# EAGLE design MJ828 - prod (EAGLE 9.4.0)
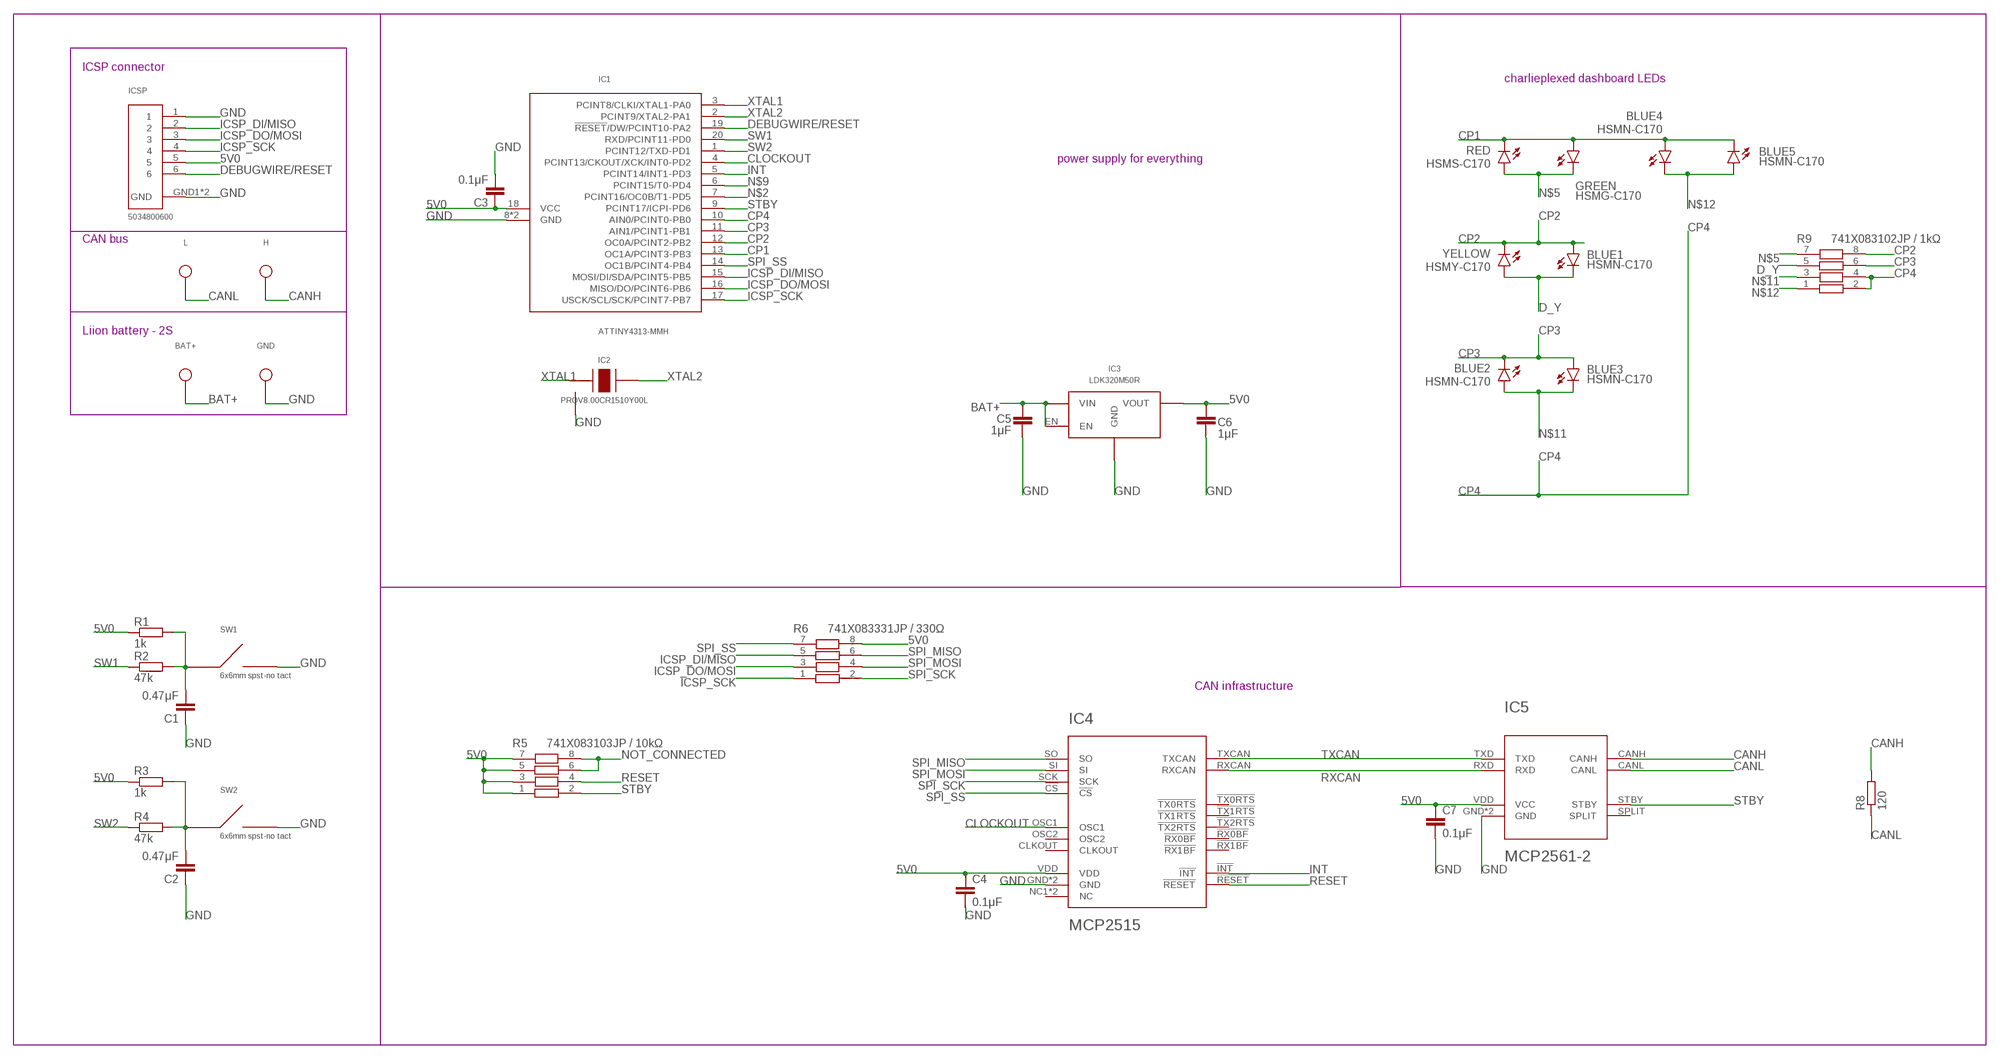
[diagram p0: schematic, sheet 1]

## Parts
BAT+  8V4 Battery +  TPTH-0.9MM  [TH-0.9MM]
BLUE1  HSMN-C170  LEDSML0805  [SML0805]
BLUE2  HSMN-C170  LEDSML0805  [SML0805]
BLUE3  HSMN-C170  LEDSML0805  [SML0805]
BLUE4  HSMN-C170  LEDSML0805  [SML0805]
BLUE5  HSMN-C170  LEDSML0805  [SML0805]
C1  0.47μF  C-EUC0402  [C0402]
C2  0.47μF  C-EUC0402  [C0402]
C3  0.1μF  C-EUC0402  [C0402]
C4  0.1μF  C-EUC0402  [C0402]
C5  1μF  C-EUC0402  [C0402]
C6  1μF  C-EUC0402  [C0402]
C7  0.1μF  C-EUC0402  [C0402]
GND  Ground  TPTH-0.9MM  [TH-0.9MM]
GREEN  HSMG-C170  LEDSML0805  [SML0805]
H  CAN High  TPTH-0.9MM  [TH-0.9MM]
IC1  ATTINY4313-MMH  ATTINY4313VQFN-20  [VQFN-20]
IC2  PRQV8.00CR1510Y00L  PRQV  [SMT]
IC3  LDK320M50R  LDK320SOT-23-5L  [SOT-23-5L]
IC4  MCP2515  MCP2515-I-ML  [QFN20]
IC5  MCP2561-2  [DFN10]
ICSP  5034800600  [SMT]
L  CAN Low  TPTH-0.9MM  [TH-0.9MM]
R1  1k  R-EU_R0402  [R0402]
R2  47k  R-EU_R0402  [R0402]
R3  1k  R-EU_R0402  [R0402]
R4  47k  R-EU_R0402  [R0402]
R5  741X083103JP / 10kΩ  741X083331JP  [0402]
R6  741X083331JP / 330Ω  741X083331JP  [0402]
R8  120  R-EU_R0402  [R0402]
R9  741X083102JP / 1kΩ  741X083331JP  [0402]
RED  HSMS-C170  LEDSML0805  [SML0805]
SW1  6x6mm spst-no tact  TL3305-844809  [SMD]
SW2  6x6mm spst-no tact  TL3305-844809  [SMD]
YELLOW  HSMY-C170  LEDSML0805  [SML0805]

## Nets
5V0 [5v0]: C3.1 C4.1 C6.2 C7.1 IC1.18(VCC) IC3.OUT(VOUT) IC4.VDD IC5.VDD(VCC) ICSP.5 R1.1 R3.1 R5.1 R5.3 R5.5 R5.7 R6.8
BAT+ [Bat+]: BAT+.TP$1 C5.1 IC3.EN IC3.IN(VIN)
CANH [5v0]: H.TP$1 IC5.CANH R8.2
CANL [5v0]: IC5.CANL L.TP$1 R8.1
CLOCKOUT [signal]: IC1.4(PCINT13/CKOUT/XCK/INT0-PD2) IC4.OSC1
CP1 [signal]: BLUE4.A BLUE5.C GREEN.A IC1.13(OC1A/PCINT3-PB3) RED.C
CP2 [signal]: BLUE1.A IC1.12(OC0A/PCINT2-PB2) R9.8 YELLOW.C
CP3 [signal]: BLUE2.C BLUE3.A IC1.11(AIN1/PCINT1-PB1) R9.6
CP4 [signal]: IC1.10(AIN0/PCINT0-PB0) R9.2 R9.4
D_Y [signal]: BLUE1.C R9.5 YELLOW.A
DEBUGWIRE/RESET [signal]: IC1.19(!RESET!/DW/PCINT10-PA2) ICSP.6
GND: C1.1 C2.1 C3.2 C4.2 C5.2 C6.1 C7.2 GND.TP$1 IC1.8(GND) IC1.GND IC2.GND IC3.GND IC4.GND IC4.GND6(GND) IC5.GND IC5.VSS(GND) ICSP.1 ICSP.GND1(GND) ICSP.GND2(GND) SW1.3 SW1.4 SW2.3 SW2.4
ICSP_DI/MISO [signal]: IC1.15(MOSI/DI/SDA/PCINT5-PB5) ICSP.2 R6.5
ICSP_DO/MOSI [signal]: IC1.16(MISO/DO/PCINT6-PB6) ICSP.3 R6.3
ICSP_SCK [signal]: IC1.17(USCK/SCL/SCK/PCINT7-PB7) ICSP.4 R6.1
INT [signal]: IC1.5(PCINT14/INT1-PD3) IC4.!INT!
N$1: C1.2 R1.2 R2.2 SW1.1 SW1.2
N$2: IC1.7(PCINT16/OC0B/T1-PD5)
N$5 [signal]: GREEN.C R9.7 RED.A
N$7: C2.2 R3.2 R4.2 SW2.1 SW2.2
N$9: IC1.6(PCINT15/T0-PD4)
N$11 [signal]: BLUE2.A BLUE3.C R9.3
N$12 [signal]: BLUE4.C BLUE5.A R9.1
NOT_CONNECTED: R5.6 R5.8
RESET [signal]: IC4.!RESET! R5.4
RXCAN [signal]: IC4.RXCAN IC5.RXD
SPI_MISO [signal]: IC4.SO R6.6
SPI_MOSI [signal]: IC4.SI R6.4
SPI_SCK: IC4.SCK R6.2
SPI_SS [signal]: IC1.14(OC1B/PCINT4-PB4) IC4.!CS! R6.7
STBY [signal]: IC1.9(PCINT17/ICPI-PD6) IC5.STBY R5.2
SW1 [signal]: IC1.20(RXD/PCINT11-PD0) R2.1
SW2 [signal]: IC1.1(PCINT12/TXD-PD1) R4.1
TXCAN [signal]: IC4.TXCAN IC5.TXD
XTAL1 [signal]: IC1.3(PCINT8/CLKI/XTAL1-PA0) IC2.XTAL1
XTAL2 [signal]: IC1.2(PCINT9/XTAL2-PA1) IC2.XTAL2
Unconnected: IC4.!RX0BF! IC4.!RX1BF! IC4.!TX0RTS! IC4.!TX1RTS! IC4.!TX2RTS! IC4.CLKOUT IC4.NC1(NC) IC4.NC2(NC) IC4.OSC2 IC5.SPLIT

## Notes on the sheet
- ICSP connector
- charlieplexed dashboard LEDs
- power supply for everything
- CAN bus
- Liion battery - 2S
- CAN infrastructure

## Library data of the parts
BAT+ GND H L = signal testpoint:TP
BLUE1-BLUE5 GREEN RED YELLOW = led:LED: LED OSRAM: - CHIPLED LG R971, LG N971, LY N971, LG Q971, LY Q971, LO R971, LY R971 LH N974, LH R974 LS Q976, LO Q976, LY Q976 LO Q996 - Hyper CHIPLED LW Q18S LB Q993, LB Q99A, LB R99A - SideLED LS A670, LO A670, LY A670, LG A670, LP A670 LB A673, LV A673, LT A673, LW A673 LH A674 LY A675 LS A676, LA A676, LO A676, LY A676, LW A676 LS A679, LY A679, LG A679 - Hyper Micro SIDELED® LS Y876, LA Y876, LO Y876, LY Y876 LT Y87S - SmartLED LW L88C, LW L88S LB L89C, LB L89S, LG L890 LS L89K, LO L89K, LY L89K LS L896, LA L896, LO L896, LY L896 - TOPLED LS T670, LO T670, LY T670, LG T670, LP T670 LSG T670, LSP T670, LSY T670, LOP T670, LYG T670 LG T671, LOG T671, LSG T671 LB T673, LV T673, LT T673, LW T673 LH T674 LS T676, LA T676, LO T676, LY T676, LB T676, LH T676, LSB T676, LW T676 LB T67C, LV T67C, LT T67C, LS T67K, LO T67K, LY T67K, LW E67C LS E67B, LA E67B, LO E67B, LY E67B, LB E67C, LV E67C, LT E67C LW T67C LS T679, LY T679, LG T679 LS T770, LO T770, LY T770, LG T770, LP T770 LB T773, LV T773, LT T773, LW T773 LH T774 LS E675, LA E675, LY E675, LS T675 LS T776, LA T776, LO T776, LY T776, LB T776 LHGB T686 LT T68C, LB T68C - Hyper Mini TOPLED® LB M676 - Mini TOPLED Santana® LG M470 LS M47K, LO M47K, LY M47K Source: http://www.osram.convergy.de LUXEON: - LUMILED® LXK2-PW12-R00, LXK2-PW12-S00, LXK2-PW14-U00, LXK2-PW14-V00 LXK2-PM12-R00, LXK2-PM12-S00, LXK2-PM14-U00 LXK2-PE12-Q00, LXK2-PE12-R00, LXK2-PE12-S00, LXK2-PE14-T00, LXK2-PE14-U00 LXK2-PB12-K00, LXK2-PB12-L00, LXK2-PB12-M00, LXK2-PB14-N00, LXK2-PB14-P00, LXK2-PB14-Q00 LXK2-PR12-L00, LXK2-PR12-M00, LXK2-PR14-Q00, LXK2-PR14-R00 LXK2-PD12-Q00, LXK2-PD12-R00, LXK2-PD12-S00 LXK2-PH12-R00, LXK2-PH12-S00 LXK2-PL12-P00, LXK2-PL12-Q00, LXK2-PL12-R00 Source: www.luxeon.com KINGBRIGHT: KA-3528ASYC Source: www.kingbright.com
C1-C7 = rcl:C-EU: CAPACITOR, European symbol; SPICEPREFIX: C
IC1 = ATtiny4313 microcontroller:ATTINY4313; SPICEPREFIX: X
IC2 = PRQV8.00CR1510Y00L - 8MHz resonator:PRQV
IC3 = LDK320 5V LDO:LDK320
IC4 = MCP2515-I-ML - Standalonce CAN Controller with SPI Interface:MCP2515-I-ML
IC5 = MCP2561-2 - High-Speed CAN Transceiver:MCP2561-2
ICSP = 5034800600 FPC Connector:5034800600
R1-R4 R8 = rcl:R-EU_: RESISTOR, European symbol; SPICEPREFIX: R
R5 R6 R9 = 741X083331JP Resistor Array:741X083331JP
SW1 SW2 = TL3305-844809 SPST-NO Tact Switch:TL3305-844809

## Net classes
0 GND: width 0.254 mm, drill 0.254 mm, clearance 0.127 mm
1 Bat+: width 0.5 mm, drill 0.35 mm, clearance 0.2 mm
2 5v0: width 0.3 mm, drill 0.35 mm, clearance 0.2 mm
3 signal: width 0.25 mm, drill 0.35 mm, clearance 0.2 mm

## Board
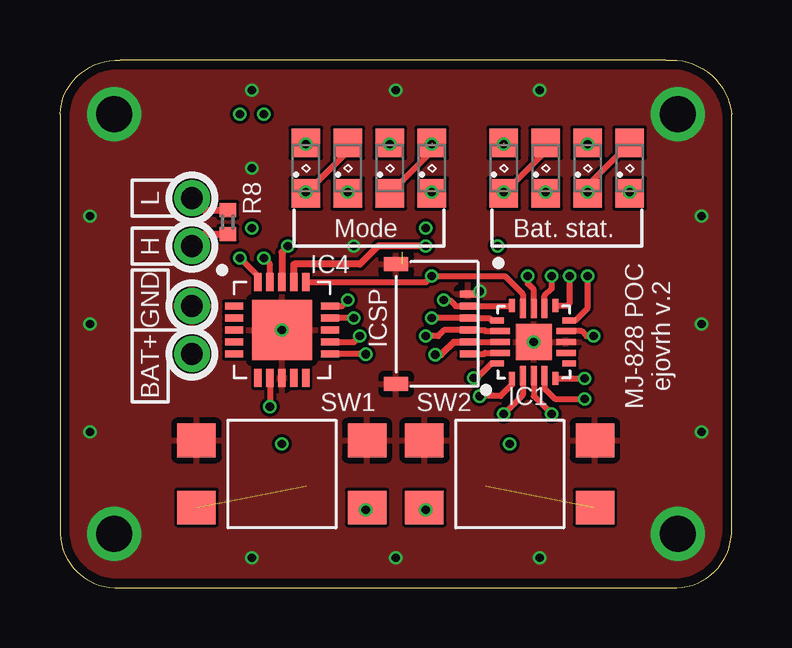
[diagram p1: board, top side]
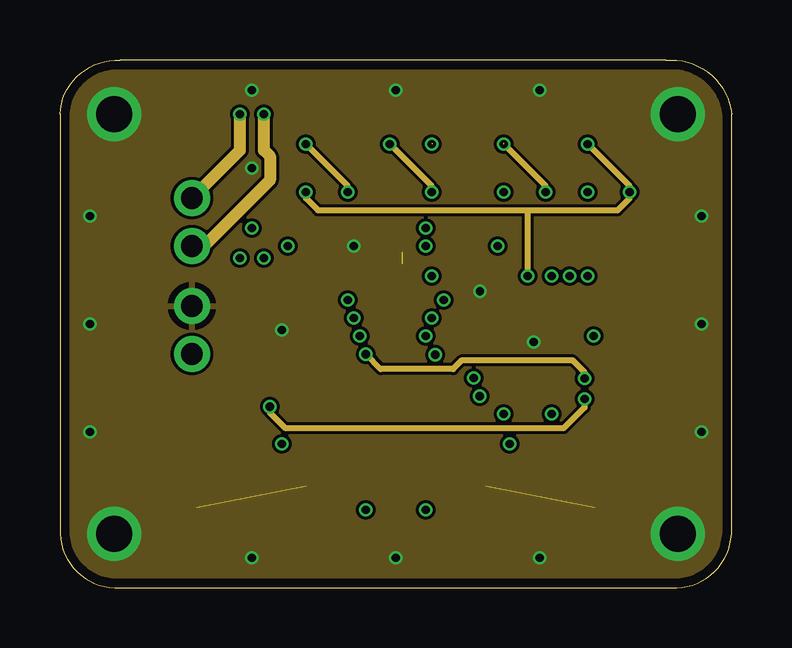
[diagram p2: board, inner layer Route2]
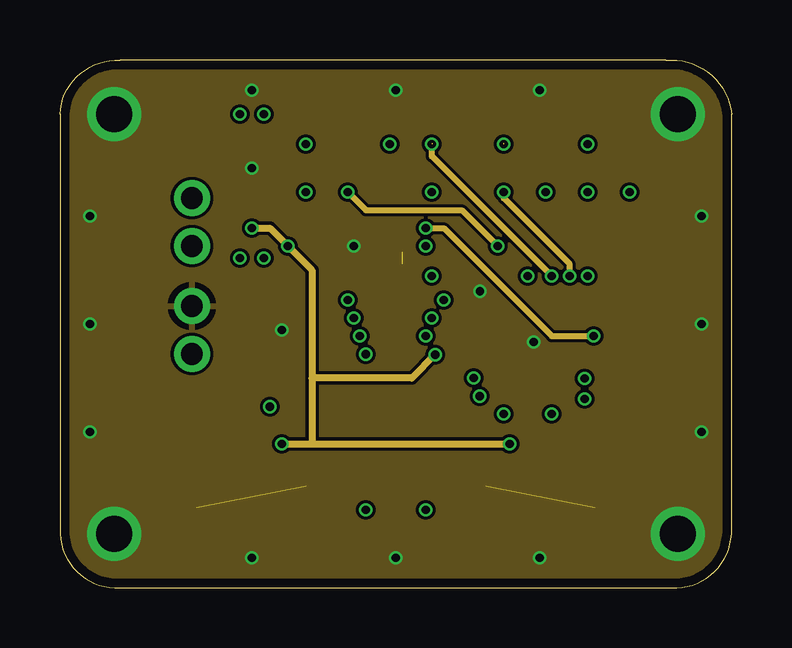
[diagram p3: board, inner layer Route15]
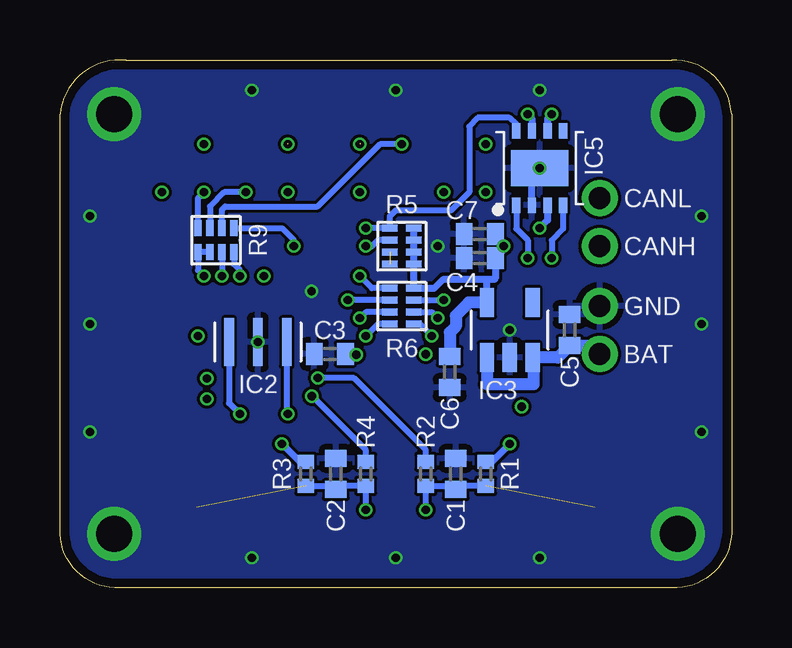
[diagram p4: board, bottom side, seen from below]

Size 28 x 22.01 mm. Coordinates in mm from the lower left corner, seen from the top.
Outline: 25.25,22 arc-90 28,19.75
Outline: 25.5,0 arc90 28,2.25
Outline: 0,2.25 arc90 2.5,0
Outline: 25.25,22 arc-90 28,19.75
Outline: 25.5,0 arc90 28,2.25
Outline: 0,2.25 arc90 2.5,0
Outline: 0,2.25 0,19.75 arc-90 2.5,22 25.25,22
Outline: 2.5,0 25.5,0
Outline: 28,2.25 28,19.75
Copper layers (1*2*15*16): Top 0.035559375mm / dielectric 0.17018125mm / Route2 0.01778125mm / dielectric 47mil / Route15 0.01778125mm / dielectric 0.17018125mm / Bottom 0.035559375mm
Design rules "oshpark-4layer *": minimum track width 5mil, minimum drill 10mil, track to track 5mil, track to pad 5mil, pad to pad 5mil, via to via 5mil, smd to smd 5mil, copper to edge 15mil, drill to drill 6mil, minimum pad ring 4mil, minimum via ring 4mil, stop-mask expansion 2.5mil, vias tented up to drill 0mil, thermal gap 10mil

### Footprints (pad centres in the part's own frame; a part is rotated, then mirrored left to right if it is on the bottom)
TH-0.9MM = drill 0.9 pad 1.5: TP$1 0,0
SML0805 = smd 1.2 x 1.2: A 1.05,0; C -1.05,0
C0402 = smd 0.7 x 0.9: 1 -0.65,0; 2 0.65,0
VQFN-20 = smd 0.55 x 0.25: 1 -1.52,0.9; 5 -1.52,-0.9; 11 1.52,-0.9; 15 1.52,0.9 | smd 0.8 x 0.25: 2 -1.4,0.45; 3 -1.4,0; 4 -1.4,-0.45; 12 1.4,-0.45; 13 1.4,0; 14 1.4,0.45 | smd 0.25 x 0.55: 6 -0.9,-1.48; 10 0.9,-1.48; 16 0.9,1.52; 20 -0.9,1.52 | smd 0.25 x 0.8: 7 -0.45,-1.35; 8 0,-1.35; 9 0.45,-1.35; 17 0.45,1.4; 18 0,1.4; 19 -0.45,1.4 | smd 1.5 x 1.5: GND 0,0
SMT = smd 0.4 x 2: GND 0,0; XTAL1 -1.2,0; XTAL2 1.2,0
SOT-23-5L = smd 0.6 x 1.2: ADJ/NC -0.95,-1.15; EN -0.95,1.15; GND 0,1.15; IN 0.95,1.15; OUT 0.95,-1.15
QFN20 = smd 0.3 x 0.75: !CS! 1,2; !RESET! 0.5,2; !RX0BF! 1,-2; !RX1BF! 0.5,-2; GND6 0,-2; OSC1 -0.5,-2; OSC2 -1,-2; RXCAN -1,2; TXCAN -0.5,2; VDD 0,2 | smd 0.75 x 0.3: !INT! 2,-1; !TX0RTS! -2,0.5; !TX1RTS! -2,0; !TX2RTS! -2,-1; CLKOUT -2,1; NC1 -2,-0.5; NC2 2,0; SCK 2,-0.5; SI 2,0.5; SO 2,1 | smd 2.5 x 2.5: GND 0,0
DFN10 = smd 0.35 x 0.65: CANH -0.325,1.55; CANL 0.325,1.55; RXD 0.975,-1.55; SPLIT 0.975,1.55; STBY -0.975,1.55; TXD -0.975,-1.55; VDD 0.325,-1.55; VSS -0.325,-1.55 | smd 2.4 x 1.5: GND 0,0
SMT' = smd 0.3 x 0.7: 1 -1.25,1.27; 2 -0.75,1.27; 3 -0.25,1.27; 4 0.25,1.27; 5 0.75,1.27; 6 1.25,1.27 | smd 0.6 x 1: GND1 -2.5,-1.73; GND2 2.5,-1.73
R0402 = smd 0.6 x 0.7: 1 -0.5,0; 2 0.5,0
0402 = smd 0.65 x 0.3: 1 -0.5,-0.75; 2 0.5,-0.75; 3 -0.5,-0.25; 4 0.5,-0.25; 5 -0.5,0.25; 6 0.5,0.25; 7 -0.5,0.75; 8 0.5,0.75
SMD = smd 1.6 x 1.4: 1 -3.556,-1.397; 2 3.556,-1.397; 3 -3.556,1.397; 4 3.556,1.397

### Placement (x,y rotation side)
BAT+  5.5,9.75 270 top
BLUE1  15.5,17.5 90 top
BLUE2  18.5,17.5 90 top
BLUE3  20.25,17.5 90 top
BLUE4  22,17.5 90 top
BLUE5  23.75,17.5 90 top
C1  11.5,4.75 270 bottom
C2  16.5,4.75 270 bottom
C3  16.75,9.75 180 bottom
C4  10.5,13.75 180 bottom
C5  6.75,10.75 90 bottom
C6  11.75,9 90 bottom
C7  10.5,14.75 180 bottom
GND  5.5,11.75 270 top
GREEN  12,17.5 90 top
H  5.5,14.25 90 top
IC1  19.75,10.25 90 top
IC2  19.75,10.25 0 bottom
IC3  9.25,10.75 180 bottom
IC4  9.25,10.75 0 top
IC5  8,17.5 0 bottom
ICSP  5034800600  [SMT']  15.75,11 270 top
L  5.5,16.25 90 top
R1  10.25,4.75 270 bottom
R2  12.75,4.75 270 bottom
R3  17.75,4.75 270 bottom
R4  15.25,4.75 270 bottom
R5  13.75,14.25 180 bottom
R6  13.75,11.75 0 bottom
R8  7,15.25 270 top
R9  21.5,14.5 270 bottom
RED  10.25,17.5 90 top
SW1  9.25,4.75 0 top
SW2  18.75,4.75 0 top
YELLOW  13.75,17.5 90 top

### Tracks (layer width: path | path; a pad name or v marks a point on that pad's centre or on a via)
5V0  (via drill 0.35)
  Top 0.25: ICSP.5 IC1.18
  Top 0.3: v15.64,9.73 15.89,9.73 16.42,10.25 ICSP.5 | v9.5,14.25 9.25,14 IC4.VDD
  Route15 0.3: v8,15 8.75,15 v9.5,14.25 10.5,13.25 10.5,8.75 | v9.25,6 10.5,6 | 10.5,6 v18.75,6 | 10.5,8.75 10.5,6 | v15.64,9.73 14.67,8.75 10.5,8.75
  Bottom 0.3: IC5.VDD 7.67,15.33 v8,15 | 10.25,12.88 12.01,12.88 12.39,12.5 R6.8 R5.7 R5.5 R5.3 R5.1 | 10.25,12.88 9.87,12.88 9.85,12.9 C4.1 9.5,14.1 v9.5,14.25 9.85,14.6 C7.1 | IC3.OUT 10.2,12.83 10.25,12.88 | v15.64,9.73 15.67,9.75 C3.1 | v9.25,6 10,5.25 R1.1 | v18.75,6 18,5.25 R3.1
  Bottom 0.5: IC3.OUT 10.95,11.9 11.5,11.35 11.5,10.9 11.75,10.65 C6.2
BAT+
  Bottom 0.5: IC3.IN 10.2,8.5 8.25,8.5 8.25,9.6 IC3.EN 7.25,9.6 C5.1 5.85,10.1 BAT+.TP$1
CANH  (via drill 0.35)
  Top 0.3: H.TP$1 6,14.75 R8.2
  Route2 0.5: H.TP$1 6,14.25 8.75,17 8.75,18 8.5,18.25 v8.5,19.75
  Bottom 0.3: v8.5,19.75 8.32,19.58 IC5.CANH
CANL  (via drill 0.35)
  Top 0.3: L.TP$1 6,15.75 R8.1
  Route2 0.5: L.TP$1 7.5,18.25 v7.5,19.75
  Bottom 0.3: v7.5,19.75 7.67,19.58 IC5.CANL
CLOCKOUT  (via drill 0.35)
  Top 0.25: IC4.OSC1 v8.75,7.55 | IC1.4 20.2,8.32 20.64,7.88 v21.87,7.88
  Route2 0.25: v8.75,7.55 8.75,7.3 9.4,6.65 21,6.65 21.87,7.52 v21.87,7.88
CP1  (via drill 0.35)
  Top 0.25: GREEN.A 12,18.2 RED.C v10.25,16.5 | BLUE4.A v22,18.5 | BLUE5.C v23.75,16.5 | v19.5,13 19.5,12.69 19.75,12.44 IC1.13
  Route2 0.25: v22,18.5 23.75,16.75 v23.75,16.5 23.75,16.25 23.25,15.75 19.5,15.75 | v10.25,16.5 10.25,16.25 10.75,15.75 19.5,15.75 | v19.5,13 19.5,15.75
CP2  (via drill 0.35)  (1 unrouted)
  Top 0.25: IC1.12 20.2,12.18 20.5,12.48 v20.5,13 | YELLOW.C 15.5,18.2 BLUE1.A
  Route15 0.25: v20.5,13 15.5,18 v15.5,18.5
  Bottom 0.25: R9.8 20.75,13.5 20.5,13.25 v20.5,13
CP3  (via drill 0.35)
  Top 0.25: v18.5,16.5 BLUE2.C 20.25,18.2 BLUE3.A | IC1.11 21.15,11.77 21.25,11.87 v21.25,13
  Route15 0.25: v21.25,13 21.25,13.5 18.5,16.25 v18.5,16.5
  Bottom 0.25: R9.6 v21.25,13
CP4  (via drill 0.35)
  Top 0.25: IC1.10 21.48,11.15 22,11.67 v22,13
  Bottom 0.25: R9.4 R9.2 22.25,13.25 v22,13
D_Y  (via drill 0.35)
  Top 0.25: YELLOW.A v13.75,18.5 | v15.5,16.5 BLUE1.C
  Route2 0.25: v15.5,16.5 15.5,16.75 v13.75,18.5
  Bottom 0.25: R9.5 21.25,15.76 21.11,15.9 17.25,15.9 14.65,18.5 v13.75,18.5
DEBUGWIRE/RESET
  Top 0.25: ICSP.6 17.68,9.75 17.73,9.8 IC1.19
GND  (via drill 0.35, 1.5)
  Top 0.3: ICSP.1 17.39,12.25 v17.51,12.37
  Bottom 0.3: IC5.VSS 8.32,17.18 IC5.GND
  other vias: 19.75,10.25 2.25,19.75 9.25,10.75 8,17.5 2.25,2.25 25.75,2.25 25.75,19.75 12.25,14.25 14,20.75 26.75,11 14,1.25 1.25,11 1.25,6.5 1.25,15.5 26.75,15.5 26.75,6.5 20,20.75 20,1.25 8,20.75 8,1.25
  pour Top: 0,22 28,22 28,0 0,0
  pour Bottom: 0,22 28,22 28,0 0,0
  pour Route2: 0,22 28,22 28,0 0,0
  pour Route15: 0,22 0,0 28,0 28,22
ICSP_DI/MISO  (via drill 0.35)
  Top 0.25: IC1.15 18.83,11.75 ICSP.2 16.5,11.75 16.25,12 v16,12
  Bottom 0.25: R6.5 v16,12
ICSP_DO/MOSI  (via drill 0.35)
  Top 0.25: IC1.16 18,11.15 17.9,11.25 ICSP.3 v15.5,11.25
  Bottom 0.25: R6.3 15.25,11.5 v15.5,11.25
ICSP_SCK  (via drill 0.35)
  Top 0.25: IC1.17 17.75,10.7 17.7,10.75 ICSP.4 16.02,10.75 15.77,10.5 v15.25,10.5
  Bottom 0.25: R6.1 14.75,11 v15.25,10.5
INT  (via drill 0.35)
  Top 0.25: IC1.5 v21.88,8.73 | v12.75,9.75 IC4.!INT!
  Route2 0.25: v21.88,8.73 21.88,8.98 21.36,9.5 16.77,9.5 16.39,9.13 13.37,9.13 v12.75,9.75
N$1  (via drill 0.35)  (1 unrouted)
  Top 0.3: SW1.2 12.81,3.31 v12.75,3.25
  Bottom 0.254: R1.2 11.35,4.25 C1.2 11.65,4.25 R2.2 v12.75,3.25
N$5  (via drill 0.35)
  Top 0.25: RED.A v10.25,18.5
  Top 0.3: GREEN.C v12,16.5
  Route2 0.25: v10.25,18.5 12,16.75 v12,16.5
  Route15 0.25: v12,16.5 12.75,15.75 16.75,15.75 v18.25,14.25
  Bottom 0.25: v18.25,14.25 18.25,14.5 18.75,15 R9.7
N$7  (via drill 0.35)  (1 unrouted)
  Top 0.3: SW2.1 15.19,3.31 v15.25,3.25
  Bottom 0.254: R3.2 16.65,4.25 C2.2 16.35,4.25 R4.2 v15.25,3.25
N$11  (via drill 0.35)  (1 unrouted)
  Top 0.25: v20.25,16.5 BLUE3.C
  Route2 0.25: v18.5,18.5 20.25,16.75 v20.25,16.5
  Bottom 0.25: v20.25,16.5 21.15,16.5 21.75,15.9 R9.3
N$12  (via drill 0.35)
  Top 0.25: BLUE4.C v22,16.5 22,16.8 BLUE5.A
  Bottom 0.25: R9.1 22.25,16.25 v22,16.5
NOT_CONNECTED  (1 unrouted)
RESET  (via drill 0.35)
  Top 0.3: IC4.!RESET! 9.75,13.5 12.5,13.5 13.25,14.25 v15.25,14.25
  Bottom 0.25: R5.4 14.75,14.5 15,14.25 v15.25,14.25
RXCAN  (via drill 0.35)
  Top 0.25: IC4.RXCAN 8.25,13 v7.5,13.75
  Bottom 0.25: IC5.RXD 7.03,14.98 7.5,14.5 v7.5,13.75
SPI_MISO  (via drill 0.35)
  Top 0.25: IC4.SO 11.75,11.75
  Top 0.254: 11.75,11.75 v12,12
  Bottom 0.25: R6.6 v12,12
SPI_MOSI  (via drill 0.35)
  Top 0.254: v12.25,11.25 IC4.SI
  Bottom 0.25: v12.25,11.25 12.5,11.5 R6.4
SPI_SCK  (via drill 0.35)
  Top 0.254: v12.5,10.5 12.25,10.25 IC4.SCK
  Bottom 0.254: v12.5,10.5 13,11 R6.2
SPI_SS  (via drill 0.35)
  Top 0.25: IC1.14 19.3,12.25 18.55,13 v15.5,13 15.25,12.75 IC4.!CS!
  Bottom 0.25: v15.5,13 15,12.5 R6.7
STBY  (via drill 0.35)
  Top 0.25: IC1.9 21.75,10.7 21.95,10.5 v22.25,10.5
  Route15 0.25: v15.25,15 16,15 20.5,10.5 v22.25,10.5
  Bottom 0.25: v15.25,15 R5.2 14.25,15.5 14,15.75 11.69,15.75 10.94,16.5 10.94,19.25 10.59,19.6 9.25,19.6 8.97,19.33 IC5.STBY
SW1  (via drill 0.35)
  Top 0.25: IC1.20 17.98,9.35 17.38,8.75 v17.25,8.75
  Bottom 0.254: R2.1 12.75,5.75 15.75,8.75 v17.25,8.75
SW2  (via drill 0.35)
  Top 0.25: IC1.1 18.85,8.48 18.37,8 v17.5,8
  Bottom 0.254: v17.5,8 15.25,5.75 R4.1
TXCAN  (via drill 0.35)
  Top 0.25: IC4.TXCAN 8.75,13.5 v8.5,13.75
  Bottom 0.25: IC5.TXD 8.97,14.98 8.5,14.5 v8.5,13.75
XTAL1  (via drill 0.35)
  Top 0.25: v20.5,7.25 19.75,8 IC1.3
  Bottom 0.25: v20.5,7.25 20.95,7.7 IC2.XTAL1
XTAL2  (via drill 0.35)
  Top 0.25: IC1.2 19.3,8.05 v18.5,7.25
  Bottom 0.25: IC2.XTAL2 18.55,7.3 v18.5,7.25

### Text on the board
tPlace: Mode | Bat. stat. | MJ-828 POC / ejovrh v.2
bPlace: GND | BAT
bNames: CANL | CANH